# Altium schematic sheet Ethernet.SchDoc
size A4
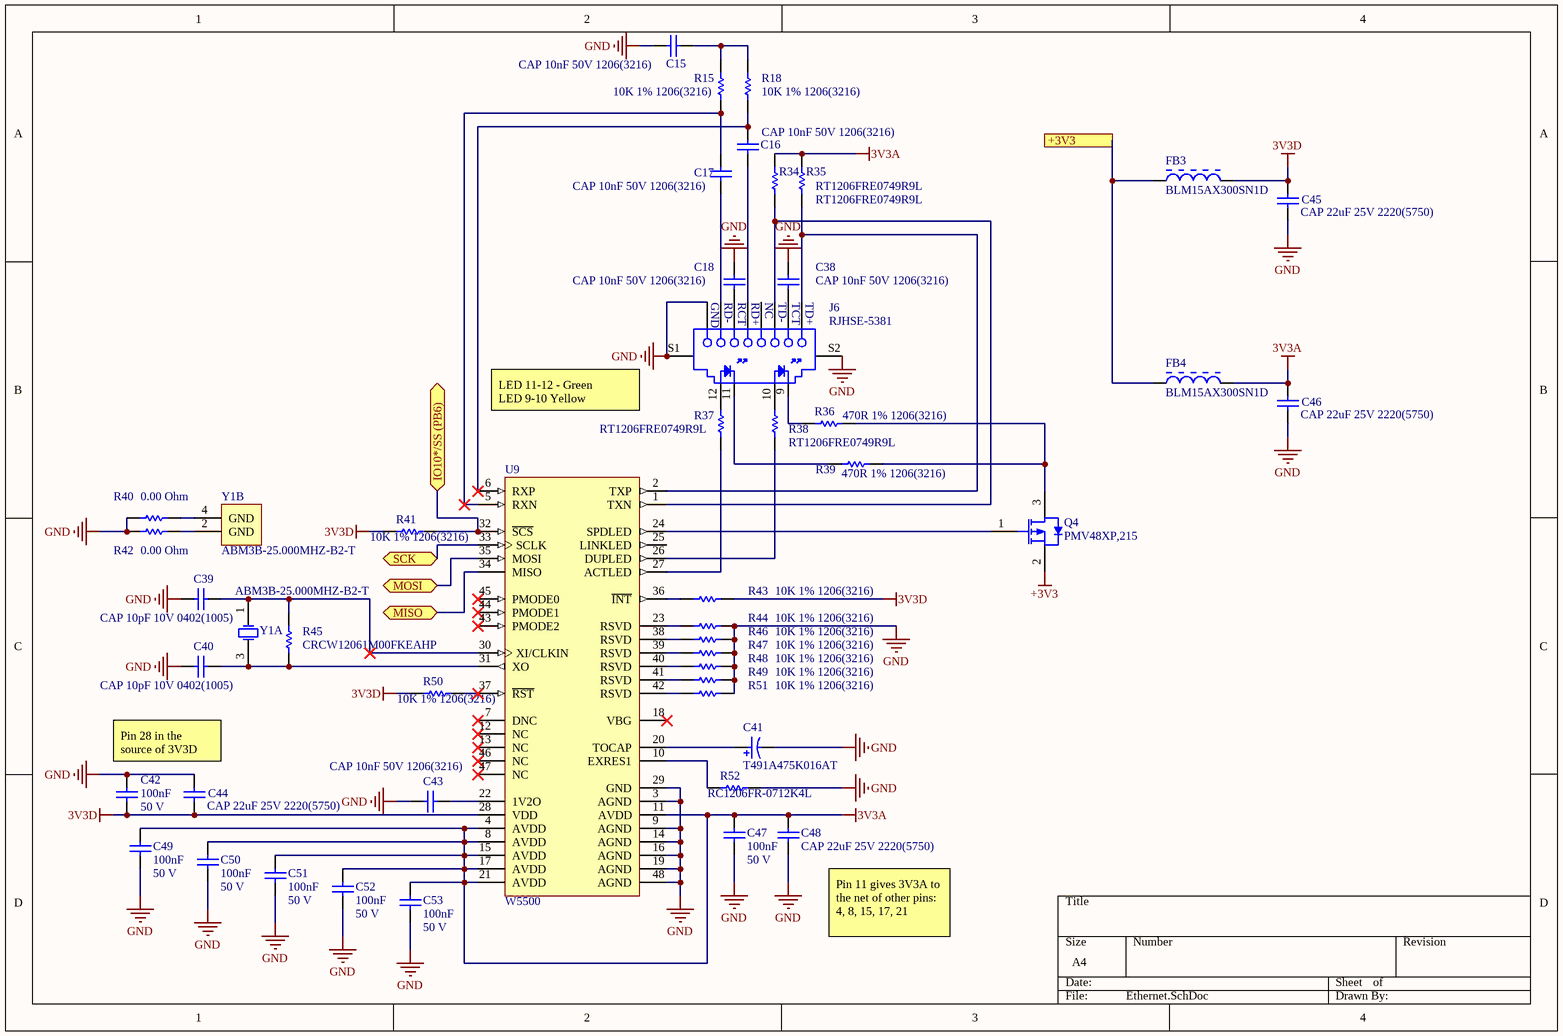
[diagram p0: Ethernet.SchDoc]

## Parts
C15  CAP 10nF 50V 1206(3216)  [CAPC1206(3216)150_L]
C16  CAP 10nF 50V 1206(3216)  [CAPC1206(3216)150_L]
C17  CAP 10nF 50V 1206(3216)  [CAPC1206(3216)150_L]
C18  CAP 10nF 50V 1206(3216)  [CAPC1206(3216)150_L]
C38  CAP 10nF 50V 1206(3216)  [CAPC1206(3216)150_L]
C39  CAP 10pF 10V 0402(1005)  [CAPC0402(1005)60_L]
C40  CAP 10pF 10V 0402(1005)  [CAPC0402(1005)60_L]
C41  T491A475K016AT  [KEMT-A-3216-18-2_L]
C42  value 100nF  Rated Voltage: 50 V  [CAPC1206(3216)100_N]  (hidden comment: CAP 100nF 50V 1206(3216))
C43  CAP 10nF 50V 1206(3216)  [CAPC1206(3216)150_L]
C44  CAP 22uF 25V 2220(5750)  [CAPC2220(5750)255_M]
C45  CAP 22uF 25V 2220(5750)  [CAPC2220(5750)255_M]
C46  CAP 22uF 25V 2220(5750)  [CAPC2220(5750)255_M]
C47  value 100nF  Rated Voltage: 50 V  [CAPC1206(3216)100_N]  (hidden comment: CAP 100nF 50V 1206(3216))
C48  CAP 22uF 25V 2220(5750)  [CAPC2220(5750)255_M]
C49  value 100nF  Rated Voltage: 50 V  [CAPC1206(3216)100_N]  (hidden comment: CAP 100nF 50V 1206(3216))
C50  value 100nF  Rated Voltage: 50 V  [CAPC1206(3216)100_N]  (hidden comment: CAP 100nF 50V 1206(3216))
C51  value 100nF  Rated Voltage: 50 V  [CAPC1206(3216)100_N]  (hidden comment: CAP 100nF 50V 1206(3216))
C52  value 100nF  Rated Voltage: 50 V  [CAPC1206(3216)100_N]  (hidden comment: CAP 100nF 50V 1206(3216))
C53  value 100nF  Rated Voltage: 50 V  [CAPC1206(3216)100_N]  (hidden comment: CAP 100nF 50V 1206(3216))
FB3  BLM15AX300SN1D  [MURA-BLM15-CHIP-2_V]
FB4  BLM15AX300SN1D  [MURA-BLM15-CHIP-2_V]
J6  RJHSE-5381  [AMPH-RJHSE-5381_V]
Q4  PMV48XP,215  [NXP-SOT23_M]
R15  10K 1% 1206(3216)  [RESC1206(3216)_L]
R18  10K 1% 1206(3216)  [RESC1206(3216)_L]
R34  RT1206FRE0749R9L  [RESC3116X65X40ML10T20]
R35  RT1206FRE0749R9L  [RESC3116X65X40ML10T20]
R36  470R 1% 1206(3216)  [RESC1206(3216)_M]
R37  RT1206FRE0749R9L  [RESC3116X65X40ML10T20]
R38  RT1206FRE0749R9L  [RESC3116X65X40ML10T20]
R39  470R 1% 1206(3216)  [RESC1206(3216)_M]
R40  value 0.00 Ohm  [RESC1206(3216)_L]  (hidden comment: Jumper 1206(3216))
R41  10K 1% 1206(3216)  [RESC1206(3216)_L]
R42  value 0.00 Ohm  [RESC1206(3216)_L]  (hidden comment: Jumper 1206(3216))
R43  10K 1% 1206(3216)  [RESC1206(3216)_L]
R44  10K 1% 1206(3216)  [RESC1206(3216)_L]
R45  CRCW12061M00FKEAHP  [RESC3116X65X50LL20T20]
R46  10K 1% 1206(3216)  [RESC1206(3216)_L]
R47  10K 1% 1206(3216)  [RESC1206(3216)_L]
R48  10K 1% 1206(3216)  [RESC1206(3216)_L]
R49  10K 1% 1206(3216)  [RESC1206(3216)_L]
R50  10K 1% 1206(3216)  [RESC1206(3216)_L]
R51  10K 1% 1206(3216)  [RESC1206(3216)_L]
R52  RC1206FR-0712K4L  [RESC3116X65X40ML10T20]
U9  W5500  [WIZ-W5500-LQFP-48_L]
Y1  ABM3B-25.000MHZ-B2-T  [ABRA-ABM3B-4_V]  (parts A,B of 2)

## Ports
+3V3, IO10*/SS (PB6) (bidir), MISO (bidir), MOSI (bidir), SCK (bidir)

## Nets
3V3A: C46.2 C47.1 C48.2 C49.1 C50.1 C51.1 C52.2 C53.2 FB4.2 R34.2 R35.2 U9.4(AVDD) U9.8(AVDD) U9.11(AVDD) U9.15(AVDD) U9.17(AVDD) U9.21(AVDD)
3V3D: C42.1 C44.1 C45.2 FB3.2 R41.1 R43.2 R50.1 U9.28(VDD)
+3V3: Q4.2(S)
GND: C15.1 C18.2 C38.2 C39.2 C40.2 C41.2 C42.2 C43.1 C44.2 C45.1 C46.1 C47.2 C48.1 C49.2 C50.2 C51.2 C52.1 C53.1 J6.8(GND) J6.S1 J6.S2 R40.2 R42.2 R44.2 R46.2 R47.2 R48.2 R49.2 R51.2 R52.2 U9.3(AGND) U9.9(AGND) U9.14(AGND) U9.16(AGND) U9.19(AGND) U9.29(GND) U9.48(AGND)
+3V3: FB3.1 FB4.1 ; port +3V3  [a separate net that carries the same name]
IO10*/SS (PB6): R41.2 U9.32(~{SCS}) ; port IO10*/SS (PB6)
MISO: U9.34(MISO) ; port MISO
MOSI: U9.35(MOSI) ; port MOSI
SCK: U9.33(SCLK) ; port SCK
NetC15_2: C15.2 R15.2 R18.2
NetC16_1: C16.1 J6.5(RD+)
NetC16_2: C16.2 R18.1 U9.6(RXP)
NetC17_1: C17.1 J6.7(RD-)
NetC17_2: C17.2 R15.1 U9.5(RXN)
NetC18_1: C18.1 J6.6(RCT)
NetC38_1: C38.1 J6.2(TCT)
NetC39_1: C39.1 R45.2 U9.30(XI/CLKIN) Y1.1(X1)
NetC40_1: C40.1 R45.1 U9.31(XO) Y1.3(X2)
NetC41_1: C41.1 U9.20(TOCAP)
NetC43_2: C43.2 U9.22(1V2O)
NetJ6_1: J6.1(TD+) R35.1 U9.2(TXP)
NetJ6_3: J6.3(TD-) R34.1 U9.1(TXN)
NetJ6_9: J6.9 R36.2
NetJ6_10: J6.10 R38.2
NetJ6_11: J6.11 R39.2
NetJ6_12: J6.12 R37.2
NetQ4_1: Q4.1(G) U9.24(SPDLED)
NetQ4_3: Q4.3(D) R36.1 R39.1
NetR37_1: R37.1 U9.27(ACTLED)
NetR38_1: R38.1 U9.26(DUPLED)
NetR40_1: R40.1 Y1.4(GND)
NetR42_1: R42.1 Y1.2(GND)
NetR43_1: R43.1 U9.36(~{INT})
NetR44_1: R44.1 U9.23(RSVD)
NetR46_1: R46.1 U9.38(RSVD)
NetR47_1: R47.1 U9.39(RSVD)
NetR48_1: R48.1 U9.40(RSVD)
NetR49_1: R49.1 U9.41(RSVD)
NetR50_2: R50.2 U9.37(~{RST})
NetR51_1: R51.1 U9.42(RSVD)
NetR52_1: R52.1 U9.10(EXRES1)

Not connected (* = marked no-connect by the designer): J6 4(NC); U9 7(DNC)* 12(NC)* 13(NC)* 18(VBG)* 25(LINKLED) 43(PMODE2)* 44(PMODE1)* 45(PMODE0)* 46(NC)* 47(NC)*

## Notes on the sheet
- LED 11-12 - Green
  LED 9-10 Yellow
- Pin 28 in the source of 3V3D
- (near C48) Pin 11 gives 3V3A to the net of other pins: 4, 8, 15, 17, 21

## Library data of the parts
C15-C18 C38 C43 = CMP-1037-03511-1: CAP 10nF 50V ±10% 1206 (3216 Metric) Thickness 1.45mm SMD; Case-Metric: 3216; Tolerance: Â±10%; Case-EIA: 1206; Value: 10nF; Rated Voltage: 50 V; Max Thickness: 1.45 mm; Technology: SMT
C39 C40 = CMP-1034-00701-1: CAP 10pF 10V ±2% 0402 (1005 Metric) Thickness 0.6mm SMD; Case-Metric: 1005; Case-EIA: 0402; Rated Voltage: 10 V; Max Thickness: 0.6 mm; Tolerance: ±2%; Value: 10pF; Technology: SMT
C41 = CMP-2000-07188-1: Tantalum Capacitor, 4.7 uF, +/- 10%, 16 V, -55 to 125 degC, 2-Pin Molded, RoHS, Tape and Reel; Manufacturer: Kemet; Capacity (elec.): 4.7µF; Nominal voltage: 16V; Content: 1pc(s); Type: T491A475K016AT; Tolerance: 10%; Mounting Technology: SurfaceMount; Package Reference: 1206; Datasheet URL: https://datasheet.ciiva.com/11793/0900766b80718482-11793043.pdf; Manufacturer URL: http://www.kemet.com/; Package Description: 2-Pin Surface Mount Device, Body 3.2 x 1.6 mm; Category: Tantalumcapacitor; Datasheet Version: 08/2014
C42 C47 C49-C53 = CMP-1037-04202-1: CAP 100nF 50V ±10% 1206 (3216 Metric) Thickness 1mm SMD; Case-Metric: 3216; Tolerance: Â±10%; Case-EIA: 1206; Technology: SMT; Max Thickness: 1 mm
C44-C46 C48 = CMP-1042-00778-1: CAP 22uF 25V ±10% 2220 (5750 Metric) Thickness 2.55mm SMD; Case-EIA: 2220; Case-Metric: 5750; Tolerance: Â±10%; Rated Voltage: 25 V; Max Thickness: 2.55 mm; Value: 22uF; Technology: SMT
FB3 FB4 = CMP-0686-00184-3: Chip Ferrite Bead for General Use, 30 Ohm, 1100 mA, -55 to 125 degC, 1 x 0.5 x 0.55 mm SMD, Tape and Reel; Manufacturer: Murata; Impedance (at 100 MHz): 30 Ohm +/- 25%; DC Resistance: 0.06 Ohm Max.; Rated Current: 1100 mA; ComponentLink3URL: http://www.murata.com/products/catalog/pdf/c31e.pdf; ComponentLink2Description: Datasheet; DatasheetVersion: 08/2013; Mounting Technology: Surface Mount; Operating Temperature Range: -55 to 125 degC; ComponentLink1URL: http://www.murata.com/; ComponentLink3Description: Package Specification; Packing: Tape and Reel; PartNumber: BLM15AX300SN1D; PackageDescription: 2-Pin Chip, Body 1 x 0.5 mm; ComponentLink2URL: http://www.murata.com/products/catalog/pdf/c31e.pdf; PackageReference: BLM15-2; ComponentLink1Description: Manufacturer URL
J6 = CMP-2000-06980-1: High Speed RJ45, Modular Jack, 8 Position, 8 Contacts, Shielded, with LEDs, -55 to 85 degC,12-Pin THD, RoHS, Tray; Manufacturer: Amphenol; Number of Positions/Contacts: 8p8c(RJ45,Ethernet); Number of Ports: 1; Catalog Drawings: RJ45SeriesRightAngle; PCN Design/Specification: MultipleSeriesCopper29/Jan/2009RJHSEShieldMaterial30/Jun/2015; Other Names: RJHSE5381; Online Catalog: RJHSESeries; Featured Product: ModularJacksProductSolutions; Tab Direction: Up; Shielding: Shielded,EMIFinger; LED Color: Yellow-Green; 3D Model: RJHSE538x.stpRJHSE538x.igs; Category: Connectors,Interconnects; Termination: Solder; Housing Material: Thermoplastic; Mounting Type: ThroughHole; Family: ModularConnectors-Jacks; Orientation: 90°Angle(Right); Features: BoardLock; Contact Material: PhosphorBronze; Mounting Technology: ThroughHole; Number of Rows: 1; Standard Package: 120; Ratings: -; Operating Temperature: -55°C~85°C; Series: RJHSE; Contact Finish: Gold; Package Reference: RJHSE-5381; Ingress Protection: -; Package Description: 12-Pin Through Hole Device, Body 16.51 x 15.75 mm; Contact Finish Thickness: 50µin(1.27µm); Datasheet URL: https://datasheet.ciiva.com/16481/rjhse538x-16481714.pdf; Datasheet Version: Rev. K, 04/2014; Connector Type: Jack; Manufacturer URL: http://www.amphenol.com/; Packaging: Tray
Q4 = CMP-1258-00160-1: P-Channel Trench MOSFET, -20 V, -3.5 A, -55 to 150 degC, 3-Pin SOT23, Tape and Reel; Manufacturer: NXP Semiconductors; VGSth [typ] (V): -1; Ciss [typ] (pF): 1000; Coss [typ] (pF): 130; Channel Type: P; Packing: Tape & Reel; PackageVersion: 06-03-16, 03/2006; ComponentLink3Description: Package Specification; Mounting Technology: Surface Mount; DatasheetVersion: Rev. 1; ComponentLink2Description: Datasheet; VDS [max] (V): -20; ComponentLink1URL: http://www.nxp.com/; ComponentLink3URL: http://www.nxp.com/documents/outline_drawing/sot023_po.pdf; ID [max] (A): -3.5; ComponentLink2URL: http://www.nxp.com/documents/data_sheet/PMV48XP.pdf; PackageDescription: 3-Pin Small Outline Transistor Package, Body 2.9 x 1.3 mm, Pitch 0.95 mm; ComponentLink1Description: Manufacturer URL; PackageReference: SOT23; PartNumber: PMV48XP,215; Code_JEDEC: TO-236AB
R15 R18 R41 R43 R44 R46-R51 = CMP-1014-00623-1: 10K 0.25W 1% 1206 (3216 Metric)  SMD; Case-Metric: 3216; Value: 10000.00 Ohm; Case-EIA: 1206; Power: 0.25 W; Technology: SMT; Tolerance: 1 %
R34 R35 R37 R38 = CMP-2003-04101-1: Manufacturer: Yageo; Part Number: RT1206FRE0749R9L
R36 R39 = CMP-1014-00473-1: 470R 0.25W 1% 1206 (3216 Metric)  SMD; Case-EIA: 1206; Value: 470.00 Ohm; Case-Metric: 3216; Technology: SMT; Power: 0.25 W; Tolerance: 1 %
R40 R42 = CMP-1014-00001-1: Jumper 1206 (3216 Metric); Tolerance: None; Case-EIA: 1206; Case-Metric: 3216; Populate: 0; Technology: SMT; Power: None
R45 = CMP-2003-04887-1: Manufacturer: Vishay Dale; Part Number: CRCW12061M00FKEAHP
R52 = CMP-2003-03547-1: Manufacturer: Yageo; Part Number: RC1206FR-0712K4L
U9 = CMP-1775-00001-1: Hardwired TCP/IP Embedded Ethernet Controller, 3.3 V, 25 MHz, -40 to 85 degC, 48-Pin LQFP, RoHS, Tray; ComponentLink1Description: Manufacturer URL; ComponentLink1URL: http://www.wiznet.co.kr/; PackageDescription: 48-Pin Low-profile Quad Flat Package, Body 7.00 x 7.00 mm, Pitch 0.50 mm; DatasheetVersion: Rev. 1.0.6, 12/2014; ComponentLink2Description: Datasheet; ComponentLink2URL: http://wizwiki.net/wiki/lib/exe/fetch.php?media=products:w5500:w5500_ds_v106e_141230.pdf; PackageReference: LQFP-48
Y1 = CMP-0277-00001-1: Crystal, SMD, 25.000000MHz Stab=50ppm 18.0pF; Manufacturer: Abracon; Packing Type: Tape & Reel; Body Shape: Rectangular; Case Size: 5.0 x 3.2 mm; PackageDescription: 4-Pin SMT Crystal, 5.2 x 3.4 mm Body; ComponentLink2Description: Datasheet; Mounting Technology: Surface Mount; ComponentLink1URL: http://www.abracon.com/; PackageReference: ABM3B; DatasheetVersion: Apr-13; PartNumber: ABM3B-25.000MHZ-B2-T; ComponentLink2URL: http://www.abracon.com/Resonators/abm3b.pdf; ComponentLink1Description: Manufacturer URL; Storage Temperature: -40 to 80 degC